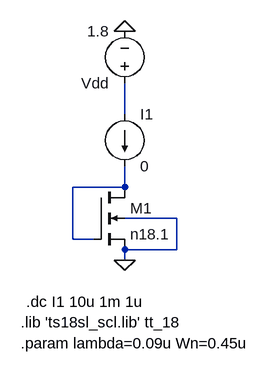
[diagram p0: schematic q2_copy.asc]
q2_copy.asc, the LTspice schematic file:
Version 4.1
SHEET 1 880 680
WIRE 144 0 144 -48
WIRE 144 112 144 80
WIRE 144 112 64 112
WIRE 224 160 144 160
WIRE 64 192 64 112
WIRE 96 192 64 192
WIRE 224 208 224 160
WIRE 224 208 144 208
WIRE 144 224 144 208
FLAG 144 -128 0
FLAG 144 224 0
SYMBOL voltage 144 -32 R180
WINDOW 123 0 0 Left 0
WINDOW 39 0 0 Left 0
SYMATTR InstName Vdd
SYMATTR Value 1.8
SYMBOL nmos4 96 112 R0
SYMATTR InstName M1
SYMATTR Value n18.1
SYMATTR Value2 l={2*lambda} w={Wn} ad={5*lambda*Wn} as={5*lambda*Wn} pd={2*Wn + 10*lambda} ps={2*Wn + 10*lambda}
SYMBOL current 144 0 R0
WINDOW 123 0 0 Left 0
WINDOW 39 0 0 Left 0
SYMATTR InstName I1
SYMATTR Value 0
TEXT -16 352 Left 2 !.param lambda=0.09u Wn=0.45u
TEXT -16 320 Left 2 !.lib 'ts18sl_scl.lib' tt_18
TEXT -8 288 Left 2 !.dc I1 10u 1m 1u

The netlist it stands for:
* q2_copy.asc
Vdd N001 0 1.8
M1 N002 N002 0 0 n18.1 l={2*lambda} w={Wn} ad={5*lambda*Wn} as={5*lambda*Wn} pd={2*Wn + 10*lambda} ps={2*Wn + 10*lambda}
I1 N001 N002 0
.model NMOS NMOS
.model PMOS PMOS
.lib standard.mos
.param lambda=0.09u Wn=0.45u
.lib 'ts18sl_scl.lib' tt_18
.dc I1 10u 1m 1u
.backanno
.end